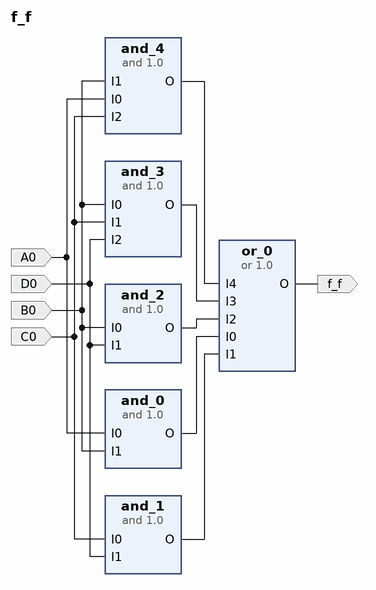
[diagram p0: block diagram of the top level]
# Vivado block design f_f, xc7a35tcpg236-1, Vivado 2018.3
create_bd_design f_f

create_bd_port -dir I -type data A0
create_bd_port -dir I -type data B0
create_bd_port -dir I -type data C0
create_bd_port -dir I -type data D0
create_bd_port -dir O -type data f_f

create_bd_cell -type ip -vlnv FIT:user:or:1.0 or_0
set_property -dict {CONFIG.Inputs 5} [get_bd_cells or_0]
create_bd_cell -type ip -vlnv FIT:user:and:1.0 and_0
set_property -dict {CONFIG.I0_Inverted true CONFIG.I1_inverted true} [get_bd_cells and_0]
create_bd_cell -type ip -vlnv FIT:user:and:1.0 and_1
set_property -dict {CONFIG.I0_Inverted true} [get_bd_cells and_1]
create_bd_cell -type ip -vlnv FIT:user:and:1.0 and_2
create_bd_cell -type ip -vlnv FIT:user:and:1.0 and_3
set_property -dict {CONFIG.I0_Inverted true CONFIG.I2_inverted true CONFIG.Inputs 3} [get_bd_cells and_3]
create_bd_cell -type ip -vlnv FIT:user:and:1.0 and_4
set_property -dict {CONFIG.I0_Inverted true CONFIG.Inputs 3} [get_bd_cells and_4]

# ---- connections ----

connect_bd_net -net A0_1 [get_bd_ports A0] [get_bd_pins and_0/I0] [get_bd_pins and_4/I0]
connect_bd_net -net B0_1 [get_bd_ports B0] [get_bd_pins and_0/I1] [get_bd_pins and_2/I0] [get_bd_pins and_3/I0] [get_bd_pins and_4/I1]
connect_bd_net -net C0_1 [get_bd_ports C0] [get_bd_pins and_1/I0] [get_bd_pins and_3/I1] [get_bd_pins and_4/I2]
connect_bd_net -net D0_1 [get_bd_ports D0] [get_bd_pins and_1/I1] [get_bd_pins and_2/I1] [get_bd_pins and_3/I2]
connect_bd_net [get_bd_pins and_0/O] [get_bd_pins or_0/I0]
connect_bd_net [get_bd_pins and_1/O] [get_bd_pins or_0/I1]
connect_bd_net [get_bd_pins and_2/O] [get_bd_pins or_0/I2]
connect_bd_net [get_bd_pins and_3/O] [get_bd_pins or_0/I3]
connect_bd_net [get_bd_pins and_4/O] [get_bd_pins or_0/I4]
connect_bd_net [get_bd_pins or_0/O] [get_bd_ports f_f]

validate_bd_design
save_bd_design
